# Altium schematic sheet HDMI_INTERFACE.SchDoc
size A4; SheetNumber: 8; SheetTotal: 27
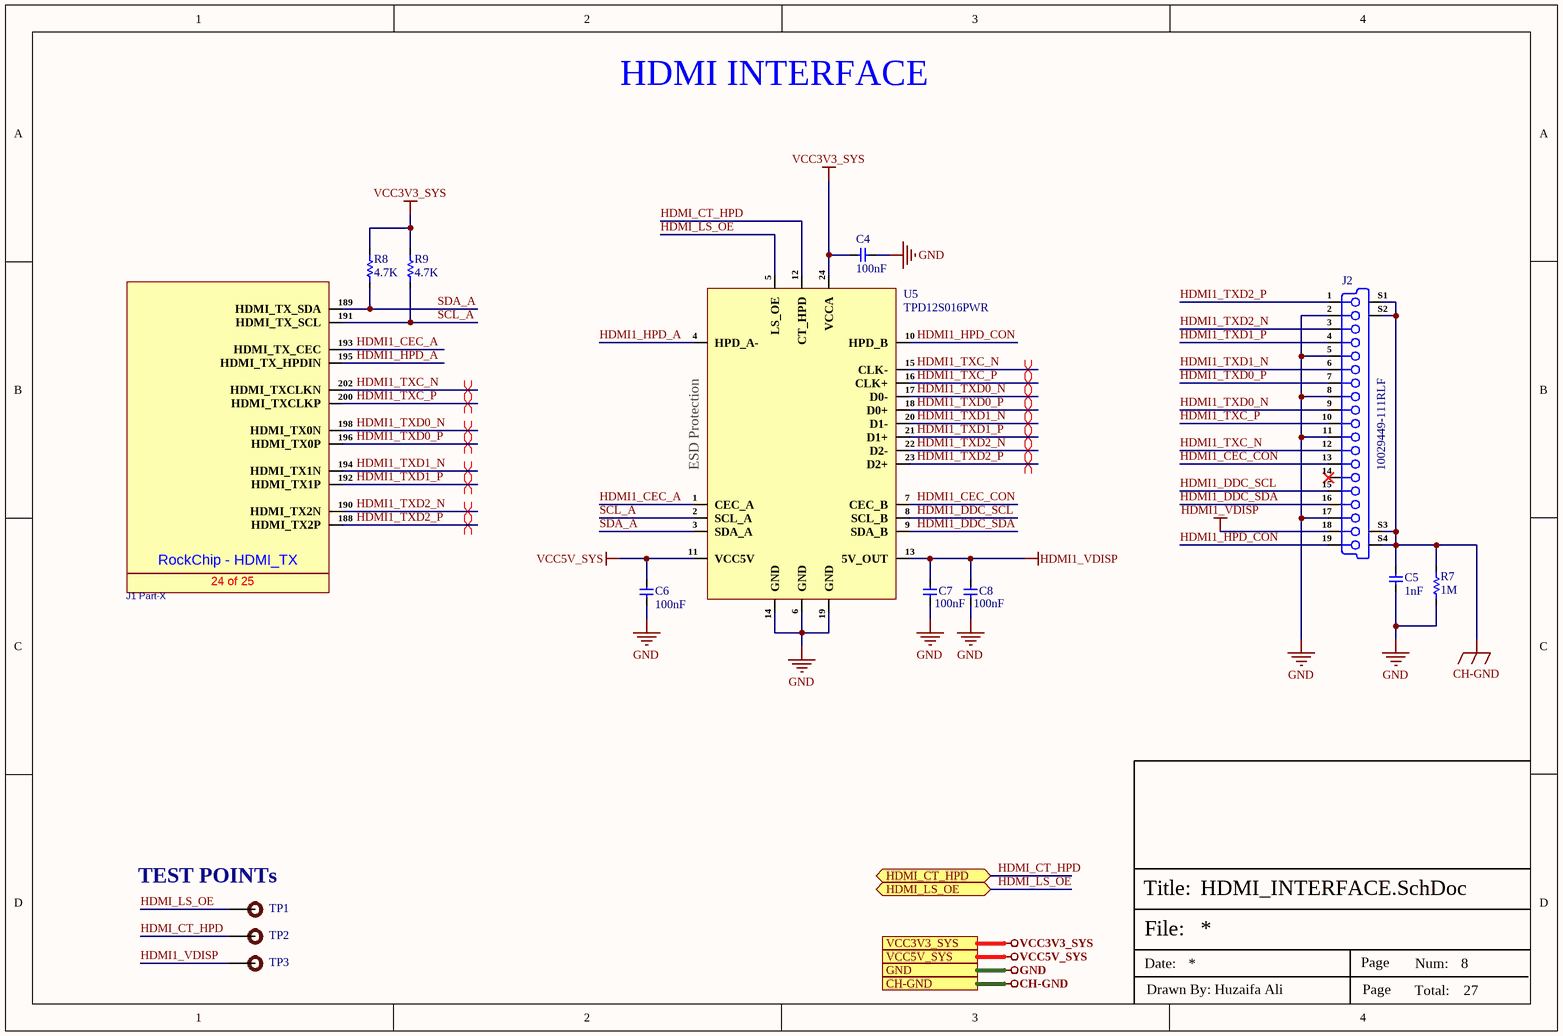
[diagram p0: HDMI_INTERFACE.SchDoc]

## Parts
C4  100nF  [Cap-0402]
C5  1nF  [Cap-1206]
C6  100nF  [Cap-0402]
C7  100nF  [Cap-0402]
C8  100nF  [Cap-0402]
J1_Part-  AS0B826-S78B-7H  [AS0B826-S78B-7H]  (value not drawn)  (part X of 25)
J2  10029449-111RLF  [10029449-111RLF]
R7  1M  [Res-0402]
R8  4.7K  [Res-0402]
R9  4.7K  [Res-0402]
TP1  TEST POINT 0.5mm Dia  [Test-point - 0.5mm]  (value not drawn)  (no BOM)
TP2  TEST POINT 0.5mm Dia  [Test-point - 0.5mm]  (value not drawn)  (no BOM)
TP3  TEST POINT 0.5mm Dia  [Test-point - 0.5mm]  (value not drawn)  (no BOM)
U5  TPD12S016PWR  [24-TSSOP]

## Ports
CH-GND (see TOP SHEET[2C], ETHERNET_PHY0[4D], ETHERNET_PHY1[4D], MICRO_SD_INTERFACE[3D], USB2.0_INTERFACE[3D], USB3.0_INTERFACE[3D], USB-C_INTERFACE[2D]), GND (see TOP SHEET[2C], AUDIO_INTERFACE[1D], BUCK REGULATOR[3D], DEBUG_UART_INTERFACE[3D], DIGITAL IO_RELAY_SHEET[5D], DUAL_SIM_INTERFACE[3D], ETHERNET_PHY0[4D], ETHERNET_PHY1[4D], GSM_INTERFACE[2D], INPUT_PROTECTION[3D], LINEAR_VOLTAGE_REG[3D], MICRO_SD_INTERFACE[3D], MIPI-DSI DISPLAY[3D], POWER SECTION[3D], PUSH BUTTONs_INTERFACE[3C], RGB_LEDs_INTERFACE[3D], ROCKCHIP_PWR_SUPPLY[1D], ROCKCHIP_SYSTEM_CONTROL[3C], RS232_RS485_INTERFACE[3C], SENSOR_SHEET[3D], USB2.0_INTERFACE[3D], USB3.0_INTERFACE[3D], USB-C_INTERFACE[2D], WIEGAND_INTERFACE[3D], WIFI_BLUETOOTH_SHEET[4C]), HDMI_CT_HPD (bidir, see TOP SHEET[2C], ROCKCHIP_GPIO_NC PINS[2D]), HDMI_LS_OE (bidir, see TOP SHEET[2C], ROCKCHIP_GPIO_NC PINS[2D]), VCC3V3_SYS (see TOP SHEET[2C], AUDIO_INTERFACE[1D], BUCK REGULATOR[3D], DEBUG_UART_INTERFACE[3D], DIGITAL IO_RELAY_SHEET[5D], ETHERNET_PHY0[4D], ETHERNET_PHY1[4D], GSM_INTERFACE[2D], LINEAR_VOLTAGE_REG[3D], MIPI-DSI DISPLAY[3D], POWER SECTION[3D], PUSH BUTTONs_INTERFACE[3C], ROCKCHIP_PWR_SUPPLY[1D], ROCKCHIP_SYSTEM_CONTROL[3C], RS232_RS485_INTERFACE[3C], SENSOR_SHEET[3D], USB-C_INTERFACE[2D], WIEGAND_INTERFACE[3D], WIFI_BLUETOOTH_SHEET[4C]), VCC5V_SYS (see TOP SHEET[2C], BUCK REGULATOR[3D], DIGITAL IO_RELAY_SHEET[5D], LINEAR_VOLTAGE_REG[3D], MIPI-DSI DISPLAY[3D], POWER SECTION[3D], RGB_LEDs_INTERFACE[3D], ROCKCHIP_PWR_SUPPLY[1D], USB2.0_INTERFACE[3D], USB3.0_INTERFACE[3D], USB-C_INTERFACE[2D], WIEGAND_INTERFACE[3D])

## Nets
CH-GND: C5.2 J2.S1(Shield) J2.S2(Shield) J2.S3(Shield) J2.S4(Shield) R7.2 ; port CH-GND
GND: C4.1 C5.1 C6.2 C7.2 C8.2 J2.2 J2.5 J2.8 J2.11 J2.17 R7.1 U5.6(GND) U5.14(GND) U5.19(GND) ; port GND
HDMI1_VDISP: C7.1 C8.1 J2.18 TP3.1 U5.13(5V_OUT)
VCC3V3_SYS: C4.2 R8.1 R9.1 U5.24(VCCA) ; port VCC3V3_SYS
VCC5V_SYS: C6.1 U5.11(VCC5V) ; port VCC5V_SYS
HDMI1_CEC_A: J1_Part-.193(HDMI_TX_CEC) U5.1(CEC_A)
HDMI1_CEC_CON: J2.13 U5.7(CEC_B)
HDMI1_DDC_SCL: J2.15 U5.8(SCL_B)
HDMI1_DDC_SDA: J2.16 U5.9(SDA_B)
HDMI1_HPD_A: J1_Part-.195(HDMI_TX_HPDIN) U5.4(HPD_A-)
HDMI1_HPD_CON: J2.19 U5.10(HPD_B)
HDMI1_TXC_N: J1_Part-.202(HDMI_TXCLKN) J2.12 U5.15(CLK-)
HDMI1_TXC_P: J1_Part-.200(HDMI_TXCLKP) J2.10 U5.16(CLK+)
HDMI1_TXD0_N: J1_Part-.198(HDMI_TX0N) J2.9 U5.17(D0-)
HDMI1_TXD0_P: J1_Part-.196(HDMI_TX0P) J2.7 U5.18(D0+)
HDMI1_TXD1_N: J1_Part-.194(HDMI_TX1N) J2.6 U5.20(D1-)
HDMI1_TXD1_P: J1_Part-.192(HDMI_TX1P) J2.4 U5.21(D1+)
HDMI1_TXD2_N: J1_Part-.190(HDMI_TX2N) J2.3 U5.22(D2-)
HDMI1_TXD2_P: J1_Part-.188(HDMI_TX2P) J2.1 U5.23(D2+)
HDMI_CT_HPD: TP2.1 U5.12(CT_HPD) ; port HDMI_CT_HPD
HDMI_LS_OE: TP1.1 U5.5(LS_OE) ; port HDMI_LS_OE
SCL_A: J1_Part-.191(HDMI_TX_SCL) R9.2 U5.2(SCL_A)
SDA_A: J1_Part-.189(HDMI_TX_SDA) R8.2 U5.3(SDA_A)

Not connected (* = marked no-connect by the designer): J2 14*

## Layout directives
differential pair; differential pair class DIFF_HDMI_100; rule Matched Net Lengths [Tolerance = 0.508mm]; rule Impedance Constraint [Min = 98.00    Max = 102.0    ]: HDMI1_TXC_N, HDMI1_TXC_P, HDMI1_TXD0_N, HDMI1_TXD0_P, HDMI1_TXD1_N, HDMI1_TXD1_P, HDMI1_TXD2_N, HDMI1_TXD2_P

## Notes on the sheet
- HDMI INTERFACE
- (near U5) ESD Protection
- (near TP1) TEST POINTs
- File:
- Title:
- Date:
- Page
- Num:
- Total:
- Drawn By: Huzaifa Ali
- (in symbol AS0B826-S78B-7H, part X) RockChip - HDMI_TX; 24 of 25

## Library data of the parts
C4 C6-C8 = CC0402KRX5R7BB104: CAP CER 0.1UF 16V X5R 0402; Manufacturer: Yageo; Tolerance: 10%; Manufacturer Part Number: CC0402KRX5R7BB104; RoHS: Yes; Category: Ceramic Capacitors; Supplier 1: Mouser; Stock 1: 936792; Pricing 1: 1=0.10000, 10=0.02300, 50=0.02300, 100=0.01100, 1000=0.00600, 10000=0.00400 (USD); Mount: Surface Mount; Case/Package: 0402; Number of Pins: 2; Case Code (Metric): 1005; Case Code (Imperial): 0402; Min Operating Temperature: -55°C; Max Operating Temperature: 85°C; Capacitance: 100nF; Dielectric: X5R; Packaging: Tape and Reel; Voltage Rating: 16V; Package Quantity: 1; Voltage Rating (DC): 16V; Termination: SMD/SMT; Resistor Type: Ceramic; Series: CC; Construction: Flat; Length: 1mm; Width: 0.02inch; Height: 0.5mm; Thickness: 0.022inch; Depth: 0.5mm; Radiation Hardening: No; REACH SVHC: Unknown; Lead Free: Lead Free; Halogen Free: Halogen Free; RoHS Compliant: Yes; ComponentLink1URL: https://datasheet.ciiva.com/155/mlccorderingcode-155879.pdf?src-supplier=Digi-Key; ComponentLink1Description: https://datasheet.ciiva.com/155/mlccorderingcode-155879.pdf?src-supplier=Digi-Key; ComponentLink2URL: https://datasheet.ciiva.com/155/mlccorderingcode-155878.pdf?src-supplier=Digi-Key; ComponentLink2Description: https://datasheet.ciiva.com/155/mlccorderingcode-155878.pdf?src-supplier=Digi-Key; ComponentLink3URL: https://datasheet.ciiva.com/155/mlccorderingcode-155880.pdf?src-supplier=Digi-Key; ComponentLink3Description: https://datasheet.ciiva.com/155/mlccorderingcode-155880.pdf?src-supplier=Digi-Key; ComponentLink4URL: https://datasheet.ciiva.com/11464/upy-gphc-x5r-4v-to-50v-12-11464869.pdf?src-supplier=Avnet; ComponentLink4Description: https://datasheet.ciiva.com/11464/upy-gphc-x5r-4v-to-50v-12-11464869.pdf?src-supplier=Avnet; Supplier Part Number 1: 603-CC402KRX5R7BB104; LCSC Part Number: C106204
C5 = CC1206KKX7RDBB102: CAP CER 1000PF 2KV X7R 1206; Manufacturer: Yageo; Tolerance: 10%; Dissipation Factor: 2.5%; Insulation Resistance: 10GR; Item Type: Capacitor; Manufacturer Part Number: CC1206KKX7RDBB102; RoHS: Yes; Category: Ceramic Capacitors; Case/Package: 1206; Case Code (Metric): 3216; Case Code (Imperial): 1206; Min Operating Temperature: -55°C; Max Operating Temperature: 125°C; Voltage Rating: 2kV; Packaging: Tape and Reel; Dielectric: X7R; Termination: SMD/SMT; Voltage Rating (DC): 2kV; Series: CC; Construction: Flat; Length: 3.2mm; RoHS Compliant: Yes; ComponentLink1URL: https://datasheet.ciiva.com/23942/1449957-23942422.pdf?src-supplier=Newark; ComponentLink1Description: https://datasheet.ciiva.com/23942/1449957-23942422.pdf?src-supplier=Newark; ComponentLink2URL: https://datasheet.ciiva.com/186/upy-np0x7r-hv-1kv-to-3kv-4-186736.pdf?src-supplier=Digi-Key; ComponentLink2Description: https://datasheet.ciiva.com/186/upy-np0x7r-hv-1kv-to-3kv-4-186736.pdf?src-supplier=Digi-Key; ComponentLink3URL: https://datasheet.ciiva.com/186/upy-np0x7r-hv-1kv-to-3kv-4-186737.pdf?src-supplier=Digi-Key; ComponentLink3Description: https://datasheet.ciiva.com/186/upy-np0x7r-hv-1kv-to-3kv-4-186737.pdf?src-supplier=Digi-Key; ComponentLink4URL: https://datasheet.ciiva.com/13386/upy-gp-np0-16v-to-50v-8-13386312.pdf?src-supplier=Mouser; ComponentLink4Description: https://datasheet.ciiva.com/13386/upy-gp-np0-16v-to-50v-8-13386312.pdf?src-supplier=Mouser; ComponentLink5URL: https://datasheet.ciiva.com/186/upy-np0x7r-hv-1kv-to-3kv-4-186735.pdf?src-supplier=Digi-Key; ComponentLink5Description: https://datasheet.ciiva.com/186/upy-np0x7r-hv-1kv-to-3kv-4-186735.pdf?src-supplier=Digi-Key; Supplier 1: Digi-Key; Stock 1: 19260; Pricing 1: 1=0.35000, 10=0.24000, 50=0.16780, 100=0.14390, 500=0.10794, 1000=0.09114 (USD); Mount: Surface Mount; Number of Pins: 2; Capacitance: 1nF; Voltage: 2kV; Package Quantity: 1; Resistor Type: Ceramic; Width: 0.063inch; Height: 1.25mm; Depth: 1.6mm; Thickness: 0.057inch; Radiation Hardening: No; REACH SVHC: Unknown; Lead Free: Lead Free; Supplier Part Number 1: 311-1487-1-ND; LCSC Part Number: C23631
J1_Part- = AS0B826-S78B-7H: SMD,P=0.5mm,Surface Mount，Right Angle; Manufacturer: FOXCONN; Item Type: Card Edge Connectors; Supplier: LCSC; Manufacturer Part Number: AS0B826-S78B-7H; RoHS: No; Stock: 4979; Pricing: 1=9.21, 10=8.287, 25=7.8064, 50=7.6064, 100=7.4062 (USD); LCSC Part Number: C426232
J2 = 10029449-111RLF: CONN RCPT 1.4 HDMI 19POS SMD R/A; Manufacturer: Amphenol ICC / FCI; Item Type: HDMI Connector; Supplier 1: RSComponents; Manufacturer Part Number: 10029449-111RLF; RoHS: No; Category: Audio / Video Connectors; Stock 1: 6150; Pricing 1: 1=1471.56000 (GBP); ComponentLink1URL: https://www.verical.com/server-webapp/html/getDatasheet?partID=416866&src-supplier=Verical; ComponentLink1Description: https://www.verical.com/server-webapp/html/getDatasheet?partID=416866&src-supplier=Verical; ComponentLink2URL: http://components.arrow.com/part/dataview/51683435S9285512N8314?src-supplier=Arrow+Electronics; ComponentLink2Description: http://components.arrow.com/part/dataview/51683435S9285512N8314?src-supplier=Arrow+Electronics; ComponentLink3URL: http://portal.fciconnect.com/Comergent/en/US/adirect/fci?cmd=catProductDetail&showAddButton=true&productID=10029449111RLF&src-supplier=Mouser; ComponentLink3Description: http://portal.fciconnect.com/Comergent/en/US/adirect/fci?cmd=catProductDetail&showAddButton=true&productID=10029449111RLF&src-supplier=Mouser; ComponentLink4URL: http://www.amphenol-icc.com/media/wysiwyg/files/drawing/10029449.pdf?src-supplier=Digi-Key; ComponentLink4Description: http://www.amphenol-icc.com/media/wysiwyg/files/drawing/10029449.pdf?src-supplier=Digi-Key; ComponentLink5URL: http://www.farnell.com/datasheets/2562284.pdf?src-supplier=Farnell; ComponentLink5Description: http://www.farnell.com/datasheets/2562284.pdf?src-supplier=Farnell; Supplier Part Number 1: 1822113; LCSC Part Number: C427307
R7 = AF0402JR-071ML: RES SMD 1M OHM 5% 1/16W 0402; Manufacturer: Yageo; Temperature Coefficient: 100ppm/°C; Resistance: 1MR; Item Type: Resistor; Max Power Dissipation: 63mW; Manufacturer Part Number: AF0402JR-071ML; Case/Package: 0402; Min Operating Temperature: -55°C; Max Operating Temperature: 155°C; Packaging: Tape and Reel; Tolerance: 5%; Height: 0.015inch; ComponentLink1URL: https://www.yageo.com/upload/media/product/productsearch/datasheet/rchip/PYu-AF_51_RoHS_L_6.pdf?src-supplier=Digi-Key; ComponentLink1Description: https://www.yageo.com/upload/media/product/productsearch/datasheet/rchip/PYu-AF_51_RoHS_L_6.pdf?src-supplier=Digi-Key; Supplier 1: Digi-Key; Stock 1: 0; Pricing 1: 10000=0.00408 (USD); Length: 0.039inch; Width: 0.02inch; Supplier Part Number 1: AF0402JR-071ML-ND; LCSC Part Number: C144054; Resistor Type: Thick Film; Number of Terminations: 2; Features: Moisture Resistant,Anti-Sulfur; RoHS Compliant: Yes
R8 R9 = RC0402FR-074K7L: RES 4.7K OHM 1% 1/16W 0402; Manufacturer: Yageo; Voltage Rating (DC): 50V; Power Rating: 62.5mW; Resistance: 4.7kR; Temperature Coefficient: 100ppm/°C; Max Power Dissipation: 63mW; Item Type: Resistor; Manufacturer Part Number: RC0402FR-074K7L; RoHS: Yes; Category: Chip SMD Resistors; ComponentLink1URL: https://datasheet.ciiva.com/22661/1686128-22661342.pdf?src-supplier=Element14; ComponentLink1Description: https://datasheet.ciiva.com/22661/1686128-22661342.pdf?src-supplier=Element14; ComponentLink2URL: https://datasheet.ciiva.com/7850/1018594-7850022.pdf?src-supplier=Element14; ComponentLink2Description: https://datasheet.ciiva.com/7850/1018594-7850022.pdf?src-supplier=Element14; ComponentLink3URL: https://datasheet.ciiva.com/7850/1018594-7850023.pdf?src-supplier=Element14; ComponentLink3Description: https://datasheet.ciiva.com/7850/1018594-7850023.pdf?src-supplier=Element14; ComponentLink4URL: https://datasheet.ciiva.com/15215/getdatasheetpartid-328119-15215035.pdf?src-supplier=Verical; ComponentLink4Description: https://datasheet.ciiva.com/15215/getdatasheetpartid-328119-15215035.pdf?src-supplier=Verical; Supplier 1: Avnet; Stock 1: 2420000; Pricing 1: 10000=0.00085 (USD); Case/Package: 0402; Number of Pins: 2; Case Code (Imperial): 0402; Case Code (Metric): 1005; Size Code: 0402; Min Operating Temperature: -55°C; Max Operating Temperature: 155°C; Tolerance: 1%; Voltage Rating: 50V; Packaging: Tape and Reel; Resistor Type: Thick Film; Termination: SMD/SMT; Features: Moisture Resistant; Series: RC; Number of Terminations: 2; Resistance Tolerance: 1%; Construction: Rectangular; Length: 1mm; Width: 0.5mm; Height: 0.32mm; Depth: 0.5mm; Height - Seated (Max): 0.016inch; RoHS Compliant: Yes; Reach SVHC Compliant: Yes; Military Standard: Not; Lead Free: Lead Free; Supplier Part Number 1: RC0402FR-074K7L; LCSC Part Number: C105871
TP1-TP3 = TEST POINT 0.5mm Dia: Test Point ON; Item Type: Test Point; Manufacturer Part Number: TEST POINT 0.5mm Dia
U5 = TPD12S016PWR: IC INTERFACE SPECIALIZED 24TSSOP; Manufacturer: Texas Instruments; Supplier: Mouser; Supplier Part Number: 595-TPD12S016PWR; Manufacturer Part Number: TPD12S016PWR; RoHS: Yes; Category: Interface ICs; Stock: 8312; Pricing: 1=1.23, 10=1.11, 50=1.05, 100=0.863, 1000=0.563, 10000=0.495 (USD); ComponentLink1URL: https://datasheet.ciiva.com/1784/tpd12s016-1784288.pdf?src-supplier=Digi-Key; ComponentLink1Description: https://datasheet.ciiva.com/1784/tpd12s016-1784288.pdf?src-supplier=Digi-Key; ComponentLink2URL: https://datasheet.ciiva.com/1495/1506096-1495817.pdf?src-supplier=Element14; ComponentLink2Description: https://datasheet.ciiva.com/1495/1506096-1495817.pdf?src-supplier=Element14; ComponentLink3URL: https://datasheet.ciiva.com/26911/getdatasheetpartid-349978-26911477.pdf?src-supplier=Verical; ComponentLink3Description: https://datasheet.ciiva.com/26911/getdatasheetpartid-349978-26911477.pdf?src-supplier=Verical; ComponentLink4URL: https://datasheet.ciiva.com/41460/001188042-da-01-en-ic-hdmi-esd-pr-tpd12s016pwr-tssop-24-tid-41460279.pdf?src-supplier=Conrad; ComponentLink4Description: https://datasheet.ciiva.com/41460/001188042-da-01-en-ic-hdmi-esd-pr-tpd12s016pwr-tssop-24-tid-41460279.pdf?src-supplier=Conrad; ComponentLink5URL: https://datasheet.ciiva.com/3149/tpd12s016-3149560.pdf?src-supplier=Avnet; ComponentLink5Description: https://datasheet.ciiva.com/3149/tpd12s016-3149560.pdf?src-supplier=Avnet